# Altium schematic sheet 12v-5v_conventer.SchDoc
size A4; SheetNumber: 1; SheetTotal: 1
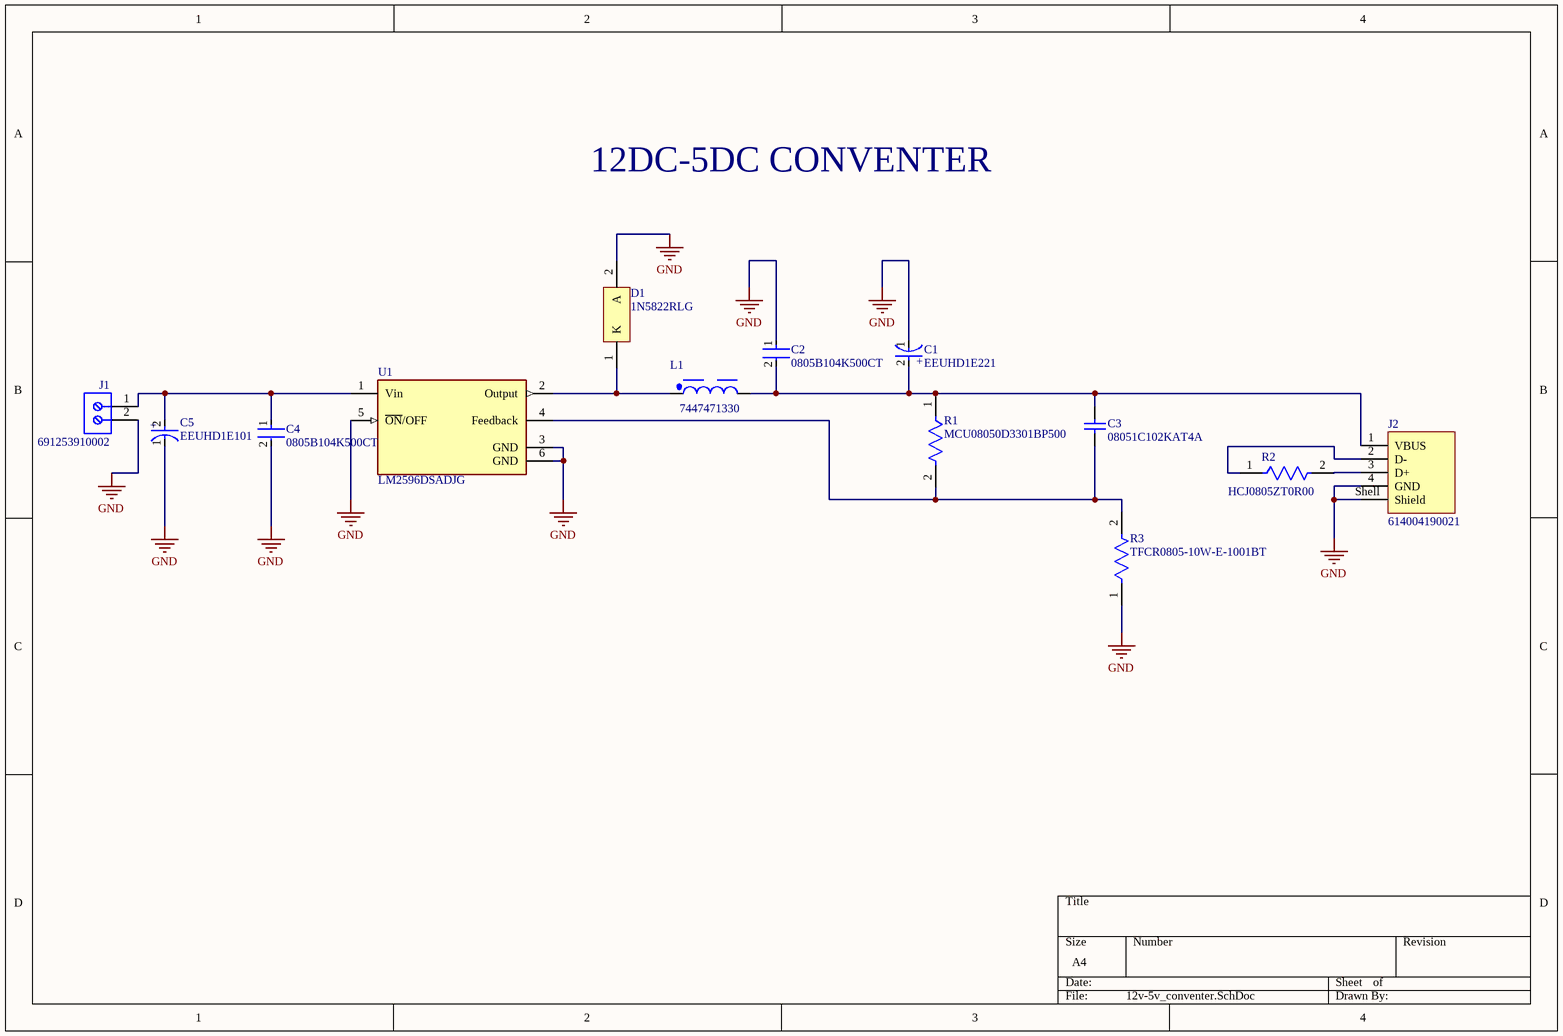
[diagram p0: 12v-5v_conventer.SchDoc]

## Parts
C1  EEUHD1E221  [FP-RAD-TH-D_8_0_5-L_11_5-MFG]
C2  0805B104K500CT  [FP-0805B-IPC_C]
C3  08051C102KAT4A  [CAPC2013X94X50LL20T25]
C4  0805B104K500CT  [FP-0805B-IPC_C]
C5  EEUHD1E101  [FP-RAD-TH-D_6_3_0_5-L_11-MFG]
D1  1N5822RLG  [ONSC-AXIAL_LEAD-2-267-05_V]
J1  691253910002  [691253910002]
J2  614004190021  [614004190021]
L1  7447471330  [WE-TIS_1111]
R1  MCU08050D3301BP500  [FP-MCU0805-IPC_A]
R2  HCJ0805ZT0R00  [FP-HCJ0805-MFG]
R3  TFCR0805-10W-E-1001BT  [FP-TFCR0805-IPC_A]
U1  LM2596DSADJG  [FP-936A-02-MFG]

## Nets
GND: C1.1(C) C2.1 C4.2 C5.1(C) D1.2(A) J1.2 J2.4(GND) J2.Shell(Shield) R3.1 U1.3(GND) U1.5(~{ON}/OFF) U1.6(GND)
NetC1_2: C1.2(A) C2.2 C3.2 J2.1(VBUS) L1.2 R1.1
NetC3_1: C3.1 R1.2 R3.2 U1.4(Feedback)
NetC4_1: C4.1 C5.2(A) J1.1 U1.1(Vin)
NetD1_1: D1.1(K) L1.1 U1.2(Output)
NetJ2_2: J2.2(D-) R2.1
NetJ2_3: J2.3(D+) R2.2

## Notes on the sheet
- 12DC-5DC CONVENTER
- (in symbol CMP-05427-000916-1) +
- (in symbol CMP-05427-001200-1) +

## Library data of the parts
C1 = CMP-05427-001200-1: Aluminum Electrolytic Capacitors (Radial Lead Type) AEC-Q200 Qualified 220uF ±20% 25V; Ripple Current (AC): 230mA; Polarity: Polar; Lead Diameter: 0.6mm; Lead/Base Style: Straight; Life (Hours): 1000Hour; Voltage Rating (DC): 25V; Max Operating Temperature: 105°C; Case/Package: Radial; Termination: Radial; Package Quantity: 200; Voltage: 25V; Height: 11.5mm; Capacitance: 220uF; Ripple Current: 230mA; Tolerance: 20%; Mount: Through Hole; Construction: RADIAL; Diameter: 8mm; RoHS Compliant: Yes; Voltage Rating: 25V; Lead Pitch: 3.5mm; Contact Plating: Tin; Height - Seated (Max): 0.512inch; Series: HD; Min Operating Temperature: -55°C; Number of Pins: 2; REACH SVHC: No SVHC; Packaging: Bulk; Length: 11.5mm
C2 C4 = CMP-45632-000003-1: CAP CER 0.1UF 50V X7R 0805; Capacitance: 100nF; Tolerance: 10%; RoHS Compliant: Yes; Packaging: Tape and Reel; Voltage Rating (DC): 50V; Voltage Rating: 50V; Length: 2mm; Lead Free: Lead Free; Voltage: 50V; Case/Package: 0805; Case Code (Metric): 2012; Depth: 1.25mm; Min Operating Temperature: -55°C; Case Code (Imperial): 0805; Max Operating Temperature: 125°C; Radiation Hardening: No; Dielectric: X7R
C3 = CMP-2007-04160-1: Manufacturer: AVX Interconnect / Elco; Part Number: 08051C102KAT4A
C5 = CMP-05427-000916-1: Aluminum Electrolytic Capacitors (Radial Lead Type) AEC-Q200 Qualified 100uF ±20% 25V; Ripple Current: 130mA; Lead/Base Style: Straight; Lead Diameter: 0.5mm; Life (Hours): 1000Hour; Polarity: Polar; Radiation Hardening: No; Voltage Rating: 25V; Tolerance: 20%; Series: Automotive, AEC-Q200, HD; Case/Package: Radial; REACH SVHC: No SVHC; Packaging: Bulk; Lead Pitch: 2.5mm; Mount: Through Hole; Min Operating Temperature: -55°C; Diameter: 6.3mm; Height - Seated (Max): 0.5inch; Capacitance: 100uF; Max Operating Temperature: 105°C; Construction: RADIAL; Package Quantity: 200; Termination: Radial; Height: 11.2mm; Ripple Current (AC): 130mA; RoHS Compliant: Yes; Voltage Rating (DC): 25V; Voltage: 25V; Number of Pins: 2; Length: 11.2mm
D1 = CMP-1055-00010-1: Rectifier, 2-Pin Axial_Lead, Pb-Free, Tape and Reel; Manufacturer: On Semiconductor; Configuration: Single; IFSM Max (A): 80; ComponentLink2URL: http://www.onsemi.cn/pub_link/Collateral/1N5820-D.PDF; Packing: Tape and Reel; ComponentLink1Description: Manufacturer URL; PackageDescription: 2-Pin, Axial Lead, Diameter 5.05 mm; ComponentLink3Description: Package Specification; PackageReference: AXIAL_LEAD-2-267-05; PartNumber: 1N5822RLG; PackageVersion: Rev. G, 06/2000; ComponentLink1URL: http://www.onsemi.com/; ComponentLink2Description: Datasheet; RoHS: TRUE; Mounting Technology: Through Hole; DatasheetVersion: Rev. 10; ComponentLink3URL: http://www.onsemi.com/pub_link/Collateral/267-05.PDF
J1 = CMP-1502-02712-3: Terminal Block, 7.5MM Pitch, Horizontal, Rising Cage Clamp, 12-30 AWG, 2 Pin
J2 = CMP-1502-03228-3: USB Connector, 2.0 TYPE A, RECEPTACLE, THT; Connector Type: USB Type A; Standard: USB 2.0; Gender: Receptacle; No. of...; USB Standard: USB 2.0; Insulation Resistance: 1GΩ; Current Rating: 3A; Number of Contacts: 4; Operating Supply Voltage: 30V; Contact Resistance: 30mΩ; Housing Color: White; Contact Material: Brass; Orientation: Horizontal; Connector Type: USB; Max Operating Temperature: 85°C; Contact Plating: Gold; Number of Pins: 4; REACH SVHC: No; Insulation Material: PBT; Min Operating Temperature: -40°C; Mount: Horizontal, Through Hole; RoHS: Compliant
L1 = CMP-1406-00003-3: Inductor Power Shielded Wirewound 33uH 20% 1KHz Ferrite 3.6A 61mOhm DCR RDL Tray; Self Resonant Frequency: 10MHz; Inductance: 33µH; Saturation Current: 2.8A; Current Rating: 3A; DC Resistance (DCR): 57mΩ; Series Resistance: 50mΩ; Lead Diameter: 650µm; Height: 11.5mm; Lead Pitch: 5mm; Features: Shielded; Min Operating Temperature: -40°C; Ambient Temperature Range Low: -40°C; Frequency: 10MHz; Ambient Temperature Range High: 85°C; RMS Current (Irms): 3.6A; Inductance Tolerance: 20%; Mount: Radial, Through Hole; Length: 11mm; Core Material: Ferrite; REACH SVHC: Unknown; Max Operating Temperature: 125°C; Max DC Current: 3.6A; Shielding: Shielded; Case/Package: Radial; Tolerance: 20%; Width: 11mm; Diameter: 11mm; Test Frequency: 1kHz; RoHS: Compliant; Number of Pins: 2
R1 = CMP-02407-010614-1: RES 1.05K OHM 0.5% 1/5W 0805; Max Power Dissipation: 125mW; Tolerance: 0.1%; Resistance: 3.3kR; Temperature Coefficient: 25ppm/°C; Width: 0.049inch; Max Operating Temperature: 125°C; Package Quantity: 5000; Packaging: Tape and Reel; Number of Terminations: 2; Case/Package: 0805; Length: 0.079inch; Composition: Thin Film; Depth: 1.25mm; Military Standard: Not; Lead Free: Lead Free; Min Operating Temperature: -55°C; Height: 0.022inch
R2 = CMP-26527-000104-1: RES 0 OHM JUMPER 1/2W 0805; Resistance: 0mR; Radiation Hardening: No; Case Code (Imperial): 0805; Number of Terminations: 2; Lead Free: Lead Free; Max Operating Temperature: 155°C; Width: 0.049inch; Case Code (Metric): 2012; Height: 0.026inch; Mount: Surface Mount; Min Operating Temperature: -55°C; Packaging: Tape and Reel; Package Quantity: 1; Termination: Wraparound; Length: 0.079inch; RoHS Compliant: Yes; Case/Package: 0805
R3 = CMP-250906-148809-1: RES Thin Film,  1kΩ, 0.1%, 0.1W, 25ppm/°C, 0805
U1 = CMP-07129-000001-1: IC REG MULT CONFG ADJ 3A D2PAK-5; Manufacturer: ON Semiconductor; Description: Buck, Boost, Buck-Boost Switching Regulator IC Positive or Negative Adjustable 1.23V 1 Output 3A TO-263-6, D²Pak (5 Leads + Tab), TO-263BA; Max Duty Cycle: 95%; Nominal Supply Current: 5mA; Standoff Height: 0mm; Min Supply Voltage: 4.5V; Output Voltage: 1.23-37V; Negative Voltage Available: true; Number Of Outputs: 1; Max Junction Temp: +125°C; Output Type: AdjustableProgrammable; Max Supply Voltage: 40V; Switching Topology: Boost,Buck,Buck-Boost; Switching Frequency: 150Hz; Output Current: 3A; Device Class L1: Integrated Circuits (ICs); Height: 4.826mm; Manufacturer Part Number: LM2596DSADJG; ComponentLink2URL: https://www.onsemi.com/pub/Collateral/LM2596-D.PDF; Device Class L3: Voltage Regulators - Switching; Octopart: https://octopart.com/lm2596dsadjg-on+semiconductor-12437034; Mouser Description: Voltage Regulators - Switching Regulators 3A BUCK SWCH 150KHZ; Automotive: No; RoHS: TRUE; Temperature Range High: +125°C; ComponentLink2Description: Datasheet; Device Class L2: Power Management ICs; Digikey Description: IC REG MULT CONFG ADJ 3A D2PAK-5; Temperature Range Low: -40°C; Footprint Url: https://www.onsemi.com/pub/Collateral/936A-02.PDF; Lead Free: Yes; Temperature: -40°C to +125°C; Package: 936A-02; Category: IC